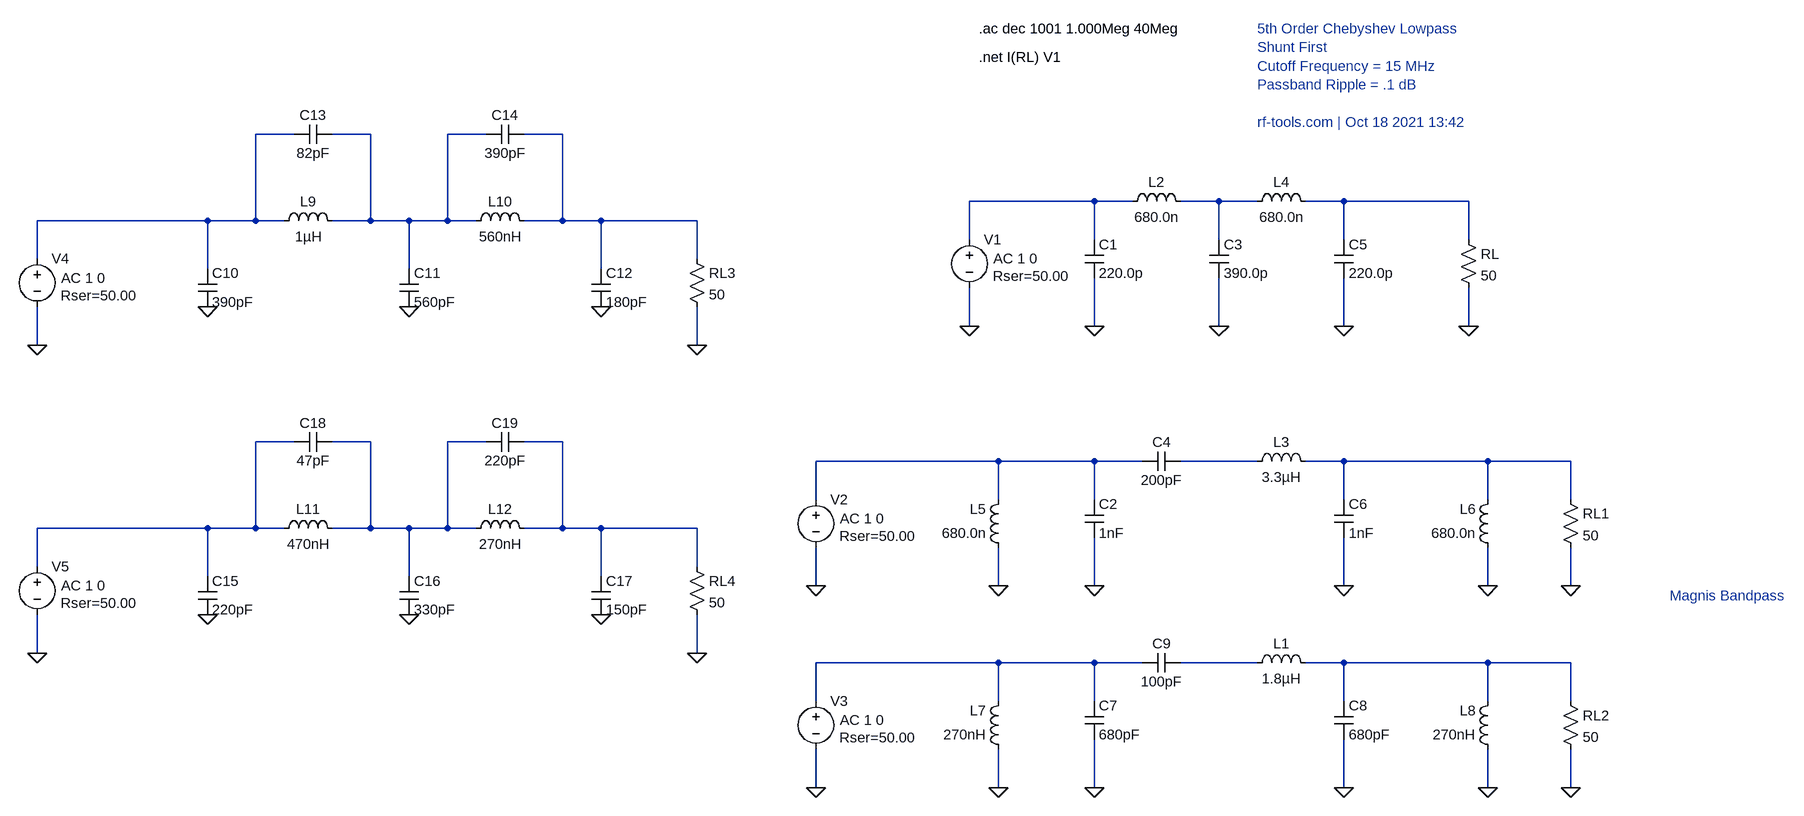
[diagram p0: schematic filter.asc]
filter.asc, the LTspice schematic file:
Version 4
SHEET 1 1732 1476
WIRE -1408 -112 -1472 -112
WIRE -1280 -112 -1344 -112
WIRE -1088 -112 -1152 -112
WIRE -960 -112 -1024 -112
WIRE 208 0 0 0
WIRE 272 0 208 0
WIRE 416 0 352 0
WIRE 480 0 416 0
WIRE 624 0 560 0
WIRE 832 0 624 0
WIRE -1552 32 -1936 32
WIRE -1472 32 -1472 -112
WIRE -1472 32 -1552 32
WIRE -1424 32 -1472 32
WIRE -1280 32 -1280 -112
WIRE -1280 32 -1344 32
WIRE -1216 32 -1280 32
WIRE -1152 32 -1152 -112
WIRE -1152 32 -1216 32
WIRE -1104 32 -1152 32
WIRE -960 32 -960 -112
WIRE -960 32 -1024 32
WIRE -896 32 -960 32
WIRE -736 32 -896 32
WIRE 0 64 0 0
WIRE 208 64 208 0
WIRE 416 64 416 0
WIRE 624 64 624 0
WIRE 832 64 832 0
WIRE -1936 96 -1936 32
WIRE -736 96 -736 32
WIRE -1552 112 -1552 32
WIRE -1216 112 -1216 32
WIRE -896 112 -896 32
WIRE 0 208 0 144
WIRE 208 208 208 128
WIRE 416 208 416 128
WIRE 624 208 624 128
WIRE 832 208 832 144
WIRE -1936 240 -1936 176
WIRE -736 240 -736 176
WIRE -1408 496 -1472 496
WIRE -1280 496 -1344 496
WIRE -1088 496 -1152 496
WIRE -960 496 -1024 496
WIRE 48 528 -256 528
WIRE 208 528 48 528
WIRE 288 528 208 528
WIRE 480 528 352 528
WIRE 624 528 560 528
WIRE 864 528 624 528
WIRE 1104 528 864 528
WIRE -256 592 -256 528
WIRE 48 592 48 528
WIRE 208 592 208 528
WIRE 624 592 624 528
WIRE 864 592 864 528
WIRE 1104 592 1104 528
WIRE -1552 640 -1936 640
WIRE -1472 640 -1472 496
WIRE -1472 640 -1552 640
WIRE -1424 640 -1472 640
WIRE -1280 640 -1280 496
WIRE -1280 640 -1344 640
WIRE -1216 640 -1280 640
WIRE -1152 640 -1152 496
WIRE -1152 640 -1216 640
WIRE -1104 640 -1152 640
WIRE -960 640 -960 496
WIRE -960 640 -1024 640
WIRE -896 640 -960 640
WIRE -736 640 -896 640
WIRE -1936 704 -1936 640
WIRE -736 704 -736 640
WIRE -1552 720 -1552 640
WIRE -1216 720 -1216 640
WIRE -896 720 -896 640
WIRE -256 736 -256 672
WIRE 48 736 48 672
WIRE 208 736 208 656
WIRE 624 736 624 656
WIRE 864 736 864 672
WIRE 1104 736 1104 672
WIRE -1936 848 -1936 784
WIRE -736 848 -736 784
WIRE 48 864 -256 864
WIRE 208 864 48 864
WIRE 288 864 208 864
WIRE 480 864 352 864
WIRE 624 864 560 864
WIRE 864 864 624 864
WIRE 1104 864 864 864
WIRE -256 928 -256 864
WIRE 48 928 48 864
WIRE 208 928 208 864
WIRE 624 928 624 864
WIRE 864 928 864 864
WIRE 1104 928 1104 864
WIRE -256 1072 -256 1008
WIRE 48 1072 48 1008
WIRE 208 1072 208 992
WIRE 624 1072 624 992
WIRE 864 1072 864 1008
WIRE 1104 1072 1104 1008
FLAG 0 208 0
FLAG 208 208 0
FLAG 416 208 0
FLAG 624 208 0
FLAG 832 208 0
FLAG -256 736 0
FLAG 208 736 0
FLAG 624 736 0
FLAG 1104 736 0
FLAG 48 736 0
FLAG 864 736 0
FLAG -256 1072 0
FLAG 208 1072 0
FLAG 624 1072 0
FLAG 1104 1072 0
FLAG 48 1072 0
FLAG 864 1072 0
FLAG -1936 240 0
FLAG -1552 176 0
FLAG -1216 176 0
FLAG -896 176 0
FLAG -736 240 0
FLAG -1936 848 0
FLAG -1552 784 0
FLAG -1216 784 0
FLAG -896 784 0
FLAG -736 848 0
SYMBOL voltage 0 48 R0
WINDOW 123 40 48 Left 2
WINDOW 39 39 77 Left 2
SYMATTR Value2 AC 1 0
SYMATTR SpiceLine Rser=50.00
SYMATTR InstName V1
SYMATTR Value ""
SYMBOL cap 192 64 R0
SYMATTR InstName C1
SYMATTR Value 220.0p
SYMBOL ind 256 16 R270
WINDOW 0 32 56 VTop 2
WINDOW 3 5 56 VBottom 2
SYMATTR InstName L2
SYMATTR Value 680.0n
SYMBOL cap 400 64 R0
SYMATTR InstName C3
SYMATTR Value 390.0p
SYMBOL ind 464 16 R270
WINDOW 0 32 56 VTop 2
WINDOW 3 5 56 VBottom 2
SYMATTR InstName L4
SYMATTR Value 680.0n
SYMBOL cap 608 64 R0
SYMATTR InstName C5
SYMATTR Value 220.0p
SYMBOL res 816 48 R0
SYMATTR InstName RL
SYMATTR Value 50
SYMBOL voltage -256 576 R0
WINDOW 123 40 48 Left 2
WINDOW 39 39 77 Left 2
SYMATTR Value2 AC 1 0
SYMATTR SpiceLine Rser=50.00
SYMATTR InstName V2
SYMATTR Value ""
SYMBOL cap 192 592 R0
SYMATTR InstName C2
SYMATTR Value 1nF
SYMBOL ind 464 544 R270
WINDOW 0 32 56 VTop 2
WINDOW 3 5 56 VBottom 2
SYMATTR InstName L3
SYMATTR Value 3.3µH
SYMBOL cap 608 592 R0
SYMATTR InstName C6
SYMATTR Value 1nF
SYMBOL res 1088 576 R0
SYMATTR InstName RL1
SYMATTR Value 50
SYMBOL ind 64 688 R180
WINDOW 0 36 80 Left 2
WINDOW 3 36 40 Left 2
SYMATTR InstName L5
SYMATTR Value 680.0n
SYMBOL ind 880 688 R180
WINDOW 0 36 80 Left 2
WINDOW 3 36 40 Left 2
SYMATTR InstName L6
SYMATTR Value 680.0n
SYMBOL cap 352 512 R90
WINDOW 0 0 32 VBottom 2
WINDOW 3 32 32 VTop 2
SYMATTR InstName C4
SYMATTR Value 200pF
SYMBOL voltage -256 912 R0
WINDOW 123 40 48 Left 2
WINDOW 39 39 77 Left 2
SYMATTR Value2 AC 1 0
SYMATTR SpiceLine Rser=50.00
SYMATTR InstName V3
SYMATTR Value ""
SYMBOL cap 192 928 R0
SYMATTR InstName C7
SYMATTR Value 680pF
SYMBOL ind 464 880 R270
WINDOW 0 32 56 VTop 2
WINDOW 3 5 56 VBottom 2
SYMATTR InstName L1
SYMATTR Value 1.8µH
SYMBOL cap 608 928 R0
SYMATTR InstName C8
SYMATTR Value 680pF
SYMBOL res 1088 912 R0
SYMATTR InstName RL2
SYMATTR Value 50
SYMBOL ind 64 1024 R180
WINDOW 0 36 80 Left 2
WINDOW 3 36 40 Left 2
SYMATTR InstName L7
SYMATTR Value 270nH
SYMBOL ind 880 1024 R180
WINDOW 0 36 80 Left 2
WINDOW 3 36 40 Left 2
SYMATTR InstName L8
SYMATTR Value 270nH
SYMBOL cap 352 848 R90
WINDOW 0 0 32 VBottom 2
WINDOW 3 32 32 VTop 2
SYMATTR InstName C9
SYMATTR Value 100pF
SYMBOL voltage -1936 80 R0
WINDOW 123 40 48 Left 2
WINDOW 39 39 77 Left 2
SYMATTR Value2 AC 1 0
SYMATTR SpiceLine Rser=50.00
SYMATTR InstName V4
SYMATTR Value ""
SYMBOL cap -1568 112 R0
SYMATTR InstName C10
SYMATTR Value 390pF
SYMBOL cap -1232 112 R0
SYMATTR InstName C11
SYMATTR Value 560pF
SYMBOL cap -912 112 R0
SYMATTR InstName C12
SYMATTR Value 180pF
SYMBOL ind -1440 48 R270
WINDOW 0 32 56 VTop 2
WINDOW 3 5 56 VBottom 2
SYMATTR InstName L9
SYMATTR Value 1µH
SYMBOL ind -1120 48 R270
WINDOW 0 32 56 VTop 2
WINDOW 3 5 56 VBottom 2
SYMATTR InstName L10
SYMATTR Value 560nH
SYMBOL cap -1344 -128 R90
WINDOW 0 0 32 VBottom 2
WINDOW 3 32 32 VTop 2
SYMATTR InstName C13
SYMATTR Value 82pF
SYMBOL cap -1024 -128 R90
WINDOW 0 0 32 VBottom 2
WINDOW 3 32 32 VTop 2
SYMATTR InstName C14
SYMATTR Value 390pF
SYMBOL res -752 80 R0
SYMATTR InstName RL3
SYMATTR Value 50
SYMBOL voltage -1936 688 R0
WINDOW 123 40 48 Left 2
WINDOW 39 39 77 Left 2
SYMATTR Value2 AC 1 0
SYMATTR SpiceLine Rser=50.00
SYMATTR InstName V5
SYMATTR Value ""
SYMBOL cap -1568 720 R0
SYMATTR InstName C15
SYMATTR Value 220pF
SYMBOL cap -1232 720 R0
SYMATTR InstName C16
SYMATTR Value 330pF
SYMBOL cap -912 720 R0
SYMATTR InstName C17
SYMATTR Value 150pF
SYMBOL ind -1440 656 R270
WINDOW 0 32 56 VTop 2
WINDOW 3 5 56 VBottom 2
SYMATTR InstName L11
SYMATTR Value 470nH
SYMBOL ind -1120 656 R270
WINDOW 0 32 56 VTop 2
WINDOW 3 5 56 VBottom 2
SYMATTR InstName L12
SYMATTR Value 270nH
SYMBOL cap -1344 480 R90
WINDOW 0 0 32 VBottom 2
WINDOW 3 32 32 VTop 2
SYMATTR InstName C18
SYMATTR Value 47pF
SYMBOL cap -1024 480 R90
WINDOW 0 0 32 VBottom 2
WINDOW 3 32 32 VTop 2
SYMATTR InstName C19
SYMATTR Value 220pF
SYMBOL res -752 688 R0
SYMATTR InstName RL4
SYMATTR Value 50
TEXT 16 -288 Left 2 !.ac dec 1001 1.000Meg 40Meg
TEXT 16 -240 Left 2 !.net I(RL) V1
TEXT 480 -288 Left 2 ;5th Order Chebyshev Lowpass\nShunt First\nCutoff Frequency = 15 MHz\nPassband Ripple = .1 dB\n\nrf-tools.com | Oct 18 2021 13:42
TEXT 1344 752 Left 2 ;Magnis Bandpass

The netlist it stands for:
* filter.asc
V1 N004 0 AC 1 0 Rser=50.00
C1 N004 0 220.0p
L2 N004 N005 680.0n
C3 N005 0 390.0p
L4 N005 N006 680.0n
C5 N006 0 220.0p
RL N006 0 50
V2 N010 0 AC 1 0 Rser=50.00
C2 N010 0 1nF
L3 N011 N012 3.3µH
C6 N012 0 1nF
RL1 N012 0 50
L5 0 N010 680.0n
L6 0 N012 680.0n
C4 N011 N010 200pF
V3 N013 0 AC 1 0 Rser=50.00
C7 N013 0 680pF
L1 N014 N015 1.8µH
C8 N015 0 680pF
RL2 N015 0 50
L7 0 N013 270nH
L8 0 N015 270nH
C9 N014 N013 100pF
V4 N001 0 AC 1 0 Rser=50.00
C10 N001 0 390pF
C11 N002 0 560pF
C12 N003 0 180pF
L9 N001 N002 1µH
L10 N002 N003 560nH
C13 N002 N001 82pF
C14 N003 N002 390pF
RL3 N003 0 50
V5 N007 0 AC 1 0 Rser=50.00
C15 N007 0 220pF
C16 N008 0 330pF
C17 N009 0 150pF
L11 N007 N008 470nH
L12 N008 N009 270nH
C18 N008 N007 47pF
C19 N009 N008 220pF
RL4 N009 0 50
.ac dec 1001 1.000Meg 40Meg
.net I(RL) V1
* 5th Order Chebyshev Lowpass
* Shunt First
* Cutoff Frequency = 15 MHz
* Passband Ripple = .1 dB
* rf-tools.com | Oct 18 2021 13:42
* Magnis Bandpass
.backanno
.end